# EAGLE schematic Atmega project (EAGLE 9.6.2)
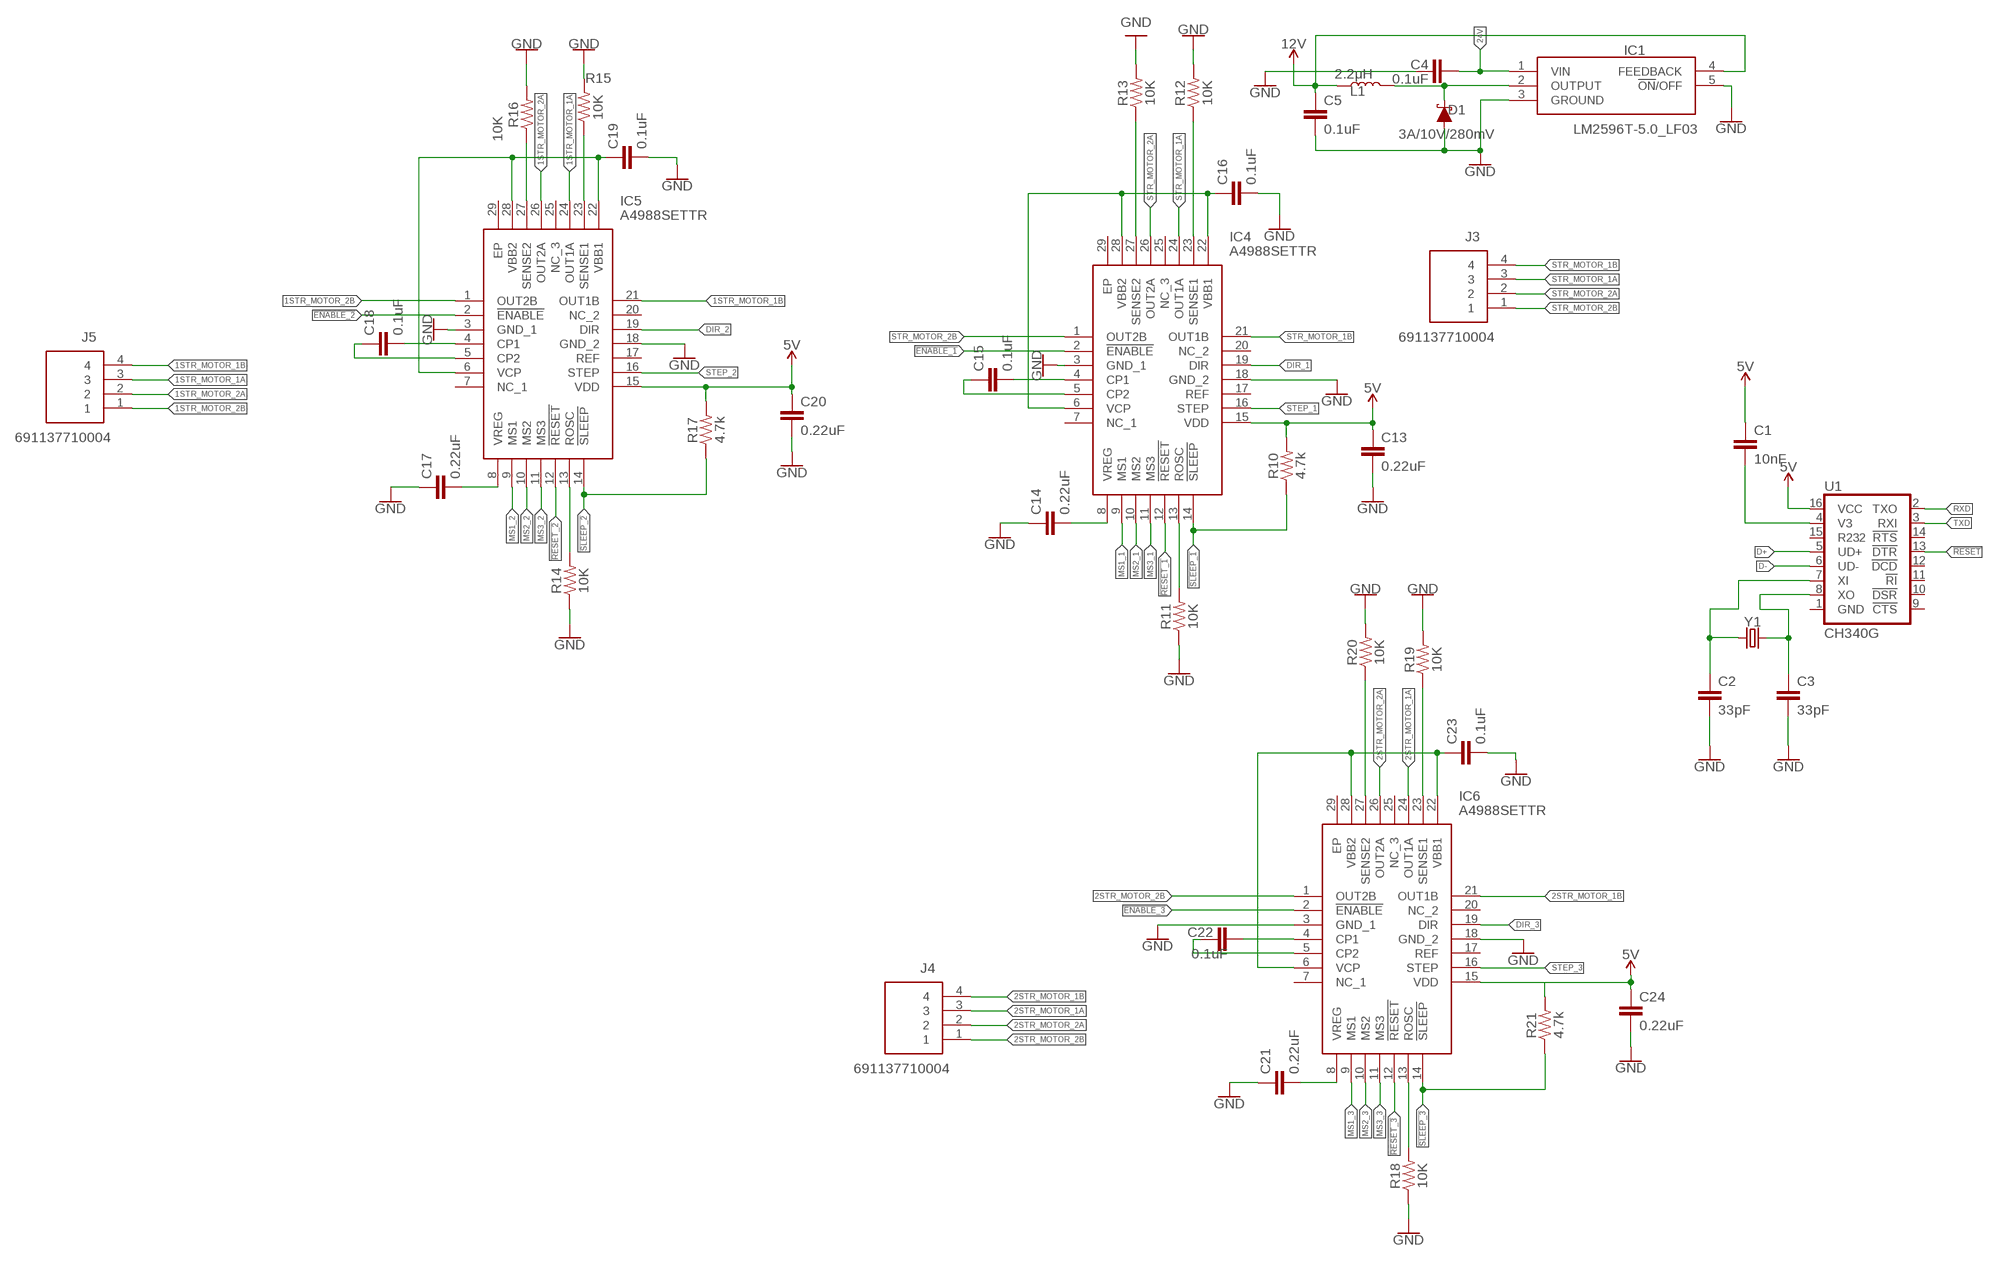
[diagram p0: schematic, sheet 1, part 1 of 2]
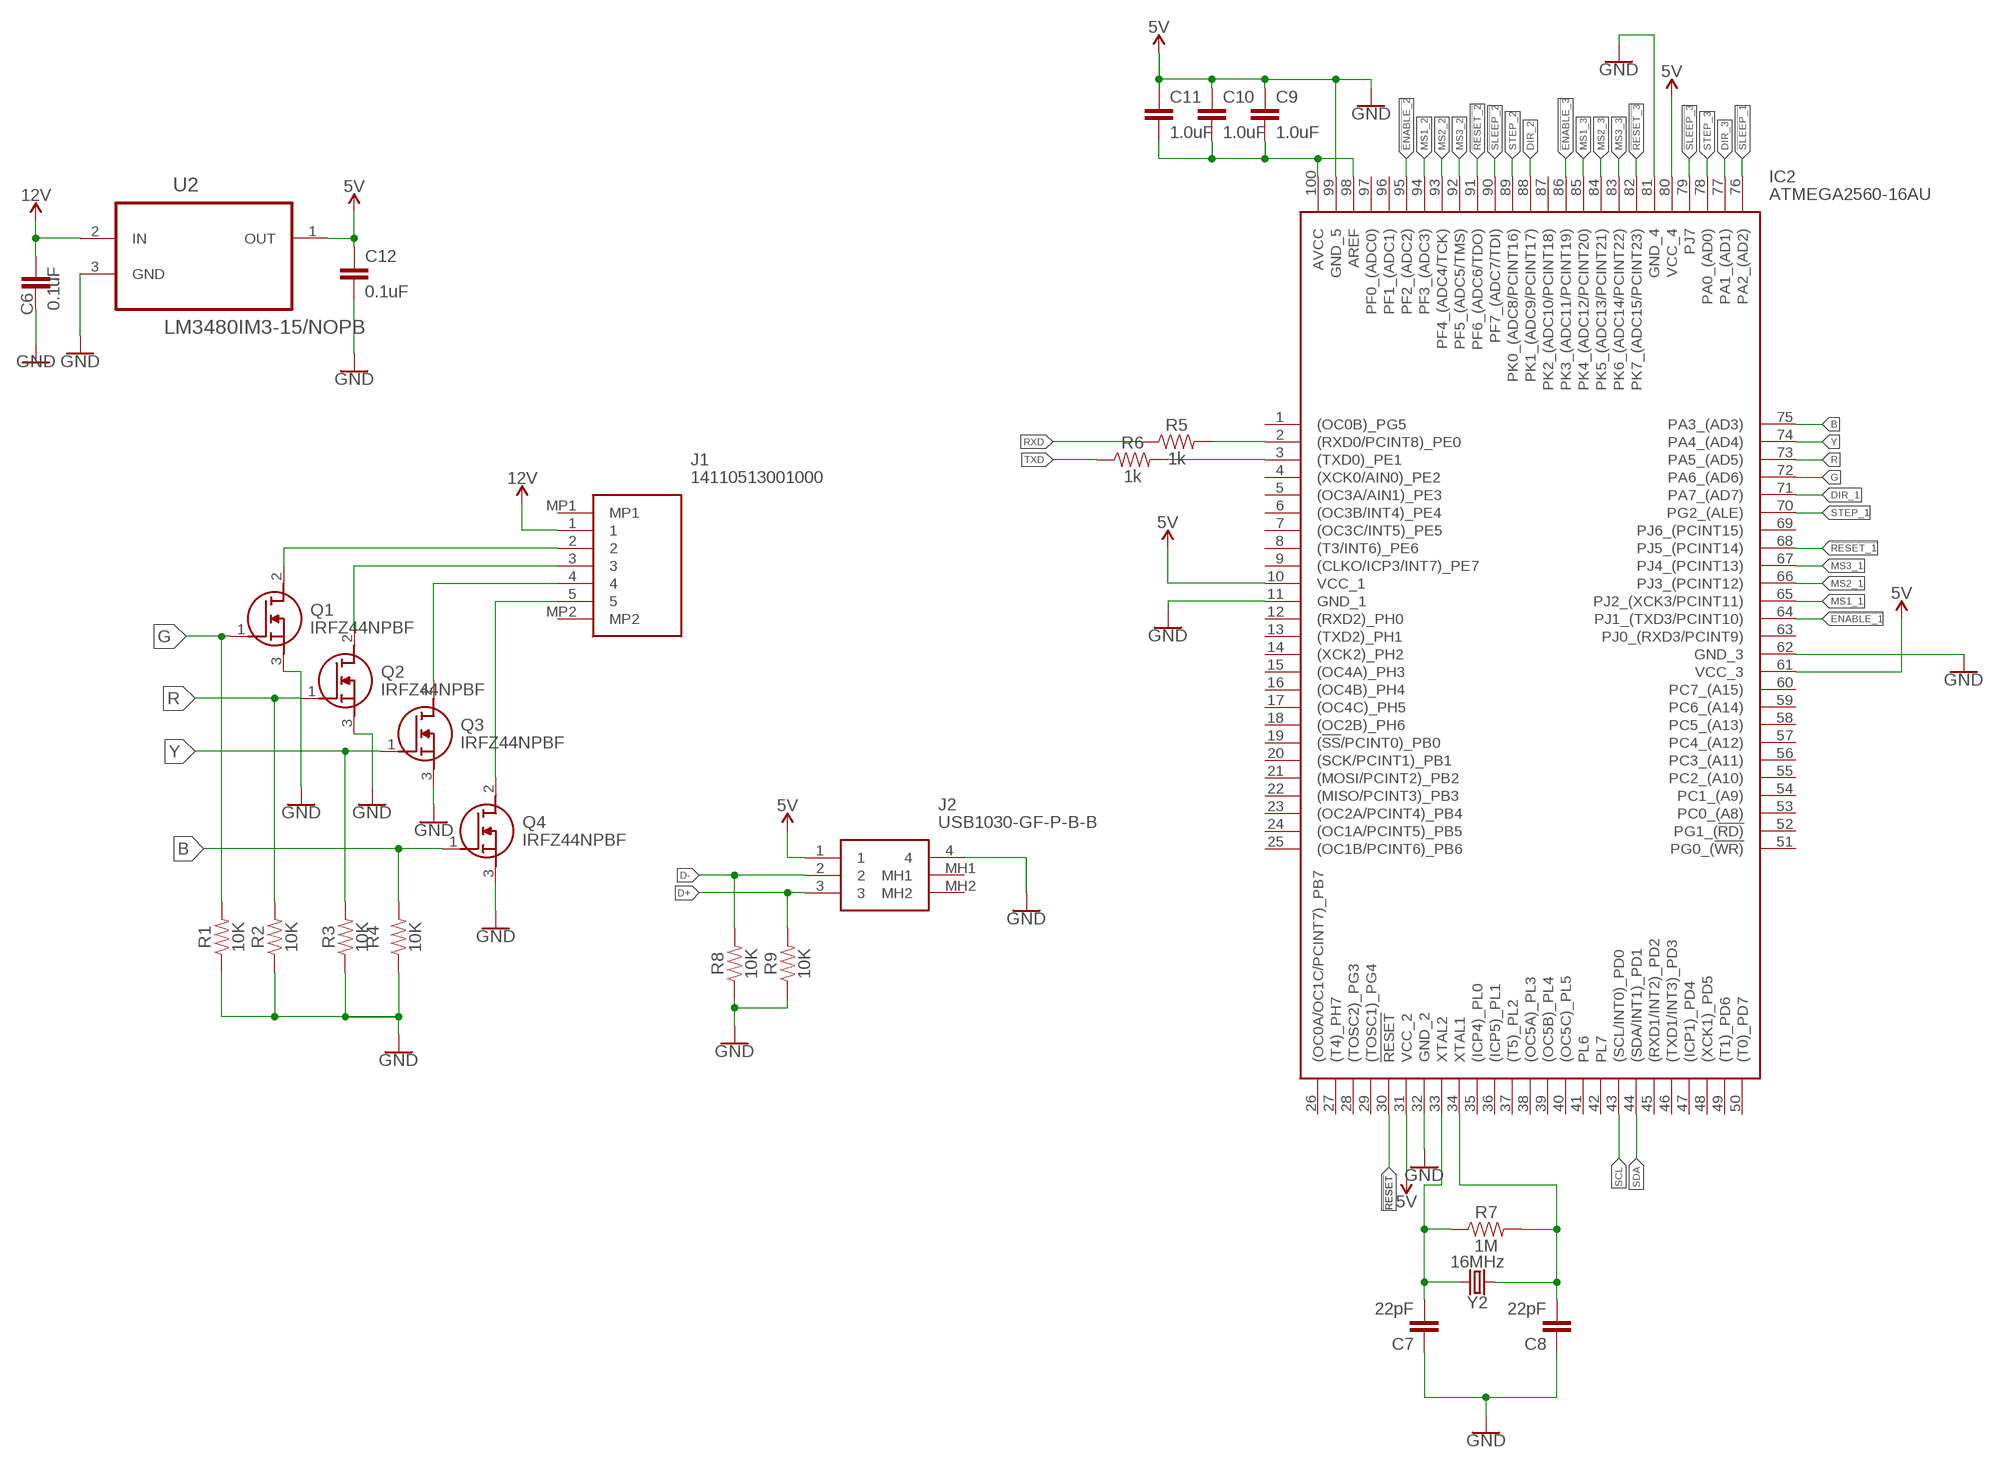
[diagram p1: schematic, sheet 1, part 2 of 2]

## Parts
C1  10nF  10NF-0402T-25V-10%  [0402-TIGHT]
C2  33pF  33PF-0402T-50V-5%  [0402-TIGHT]
C3  33pF  33PF-0402T-50V-5%  [0402-TIGHT]
C4  0.1uF  0.1UF-0603-25V-5%  [0603]
C5  0.1uF  0.1UF-0402T-16V-10%  [0402-TIGHT]
C6  0.1uF  0.1UF-0402T-16V-10%  [0402-TIGHT]
C7  22pF  22PF-0402T-16V-10%  [0402-TIGHT]
C8  22pF  22PF-0402T-16V-10%  [0402-TIGHT]
C9  1.0uF  1.0UF-0402T-16V-10%  [0402-TIGHT]
C10  1.0uF  1.0UF-0402T-16V-10%  [0402-TIGHT]
C11  1.0uF  1.0UF-0402T-16V-10%  [0402-TIGHT]
C12  0.1uF  0.1UF-0402T-6.3V-10%-X7R  [0402-TIGHT]
C13  0.22uF  0.22UF-0402T-10V-10%  [0402-TIGHT]
C14  0.22uF  0.22UF-0402T-10V-10%  [0402-TIGHT]
C15  0.1uF  0.1UF-0402T-10V-10%-X7R  [0402-TIGHT]
C16  0.1uF  0.1UF-0402T-10V-10%-X7R  [0402-TIGHT]
C17  0.22uF  0.22UF-0402T-10V-10%  [0402-TIGHT]
C18  0.1uF  0.1UF-0402T-10V-10%-X7R  [0402-TIGHT]
C19  0.1uF  0.1UF-0402T-10V-10%-X7R  [0402-TIGHT]
C20  0.22uF  0.22UF-0402T-10V-10%  [0402-TIGHT]
C21  0.22uF  0.22UF-0402T-10V-10%  [0402-TIGHT]
C22  0.1uF  0.1UF-0402T-10V-10%-X7R  [0402-TIGHT]
C23  0.1uF  0.1UF-0402T-10V-10%-X7R  [0402-TIGHT]
C24  0.22uF  0.22UF-0402T-10V-10%  [0402-TIGHT]
D1  3A/10V/280mV  DIODE-SCHOTTKY-BAT60A  [SOD-323]
IC1  LM2596T-5.0_LF03  [TO170P470X1028X2142-5P]
IC2  ATMEGA2560-16AU  [QFP50P1600X1600X120-100N]
IC4  A4988SETTR  [QFN50P500X500X100-29N]
IC5  A4988SETTR  [QFN50P500X500X100-29N]
IC6  A4988SETTR  [QFN50P500X500X100-29N]
J1  14110513001000  [14110513001000]
J2  USB1030-GF-P-B-B  [USB1030GFPBB]
J3  691137710004  [691137710004]
J4  691137710004  [691137710004]
J5  691137710004  [691137710004]
L1  2.2μH  2.2μH-0805_WIDE-2.2μH-1.7A-0.14OHM  [0805-WIDE]
Q1  IRFZ44NPBF  [TO254P483X1016X1994-3P]
Q2  IRFZ44NPBF  [TO254P483X1016X1994-3P]
Q3  IRFZ44NPBF  [TO254P483X1016X1994-3P]
Q4  IRFZ44NPBF  [TO254P483X1016X1994-3P]
R1  10K  10KOHM-0402-1/10W-0.1%  [0402-TIGHT]
R2  10K  10KOHM-0402-1/10W-0.1%  [0402-TIGHT]
R3  10K  10KOHM-0402-1/10W-0.1%  [0402-TIGHT]
R4  10K  10KOHM-0402-1/10W-0.1%  [0402-TIGHT]
R5  1k  1KOHM-0402T-1/16W-1%  [0402-TIGHT]
R6  1k  1KOHM-0402T-1/16W-1%  [0402-TIGHT]
R7  1M  1MOHM-0402T-1/16W-5%  [0402-TIGHT]
R8  10K  10KOHM-0402-1/10W-0.1%  [0402-TIGHT]
R9  10K  10KOHM-0402-1/10W-0.1%  [0402-TIGHT]
R10  4.7k  4.7KOHM-0402T-1/16W-1%  [0402-TIGHT]
R11  10K  10KOHM-0402-1/10W-0.1%  [0402-TIGHT]
R12  10K  10KOHM-0402-1/10W-0.1%  [0402-TIGHT]
R13  10K  10KOHM-0402-1/10W-0.1%  [0402-TIGHT]
R14  10K  10KOHM-0402-1/10W-0.1%  [0402-TIGHT]
R15  10K  10KOHM-0402-1/10W-0.1%  [0402-TIGHT]
R16  10K  10KOHM-0402-1/10W-0.1%  [0402-TIGHT]
R17  4.7k  4.7KOHM-0402T-1/16W-1%  [0402-TIGHT]
R18  10K  10KOHM-0402-1/10W-0.1%  [0402-TIGHT]
R19  10K  10KOHM-0402-1/10W-0.1%  [0402-TIGHT]
R20  10K  10KOHM-0402-1/10W-0.1%  [0402-TIGHT]
R21  4.7k  4.7KOHM-0402T-1/16W-1%  [0402-TIGHT]
U1  CH340G  CH340GSMD  [SO016]
U2  LM3480IM3-15/NOPB  [SOT95P251X112-3N]
Y1  CRYSTAL-12MHZ  [CRYSTAL-SMD-2X2.5MM]
Y2  16MHz  CRYSTAL-16MHZSMD-5X3.2  [CRYSTAL-SMD-5X3.2-4PAD]

## Nets
1STR_MOTOR_1A: IC5.24(OUT1A) J5.3
1STR_MOTOR_1B: IC5.21(OUT1B) J5.4
1STR_MOTOR_2A: IC5.26(OUT2A) J5.2
1STR_MOTOR_2B: IC5.1(OUT2B) J5.1
2STR_MOTOR_1A: IC6.24(OUT1A) J4.3
2STR_MOTOR_1B: IC6.21(OUT1B) J4.4
2STR_MOTOR_2A: IC6.26(OUT2A) J4.2
2STR_MOTOR_2B: IC6.1(OUT2B) J4.1
5V: C1.1 C9.1 C10.1 C11.1 C12.1 C13.1 C20.1 C24.1 IC2.10(VCC_1) IC2.31(VCC_2) IC2.61(VCC_3) IC2.80(VCC_4) IC2.99(GND_5) IC4.15(VDD) IC5.15(VDD) IC6.15(VDD) J2.1 R10.2 R17.2 R21.2 U1.16(VCC) U2.1(OUT) ; supply symbol labelled GND
12V: C5.1 C6.2 IC1.4(FEEDBACK) J1.1 L1.1 U2.2(IN)
24V: C4.2 IC1.1(VIN)
!ENABLE_1: IC2.64(PJ1_(TXD3/PCINT10)) IC4.2(!ENABLE)
!ENABLE_2: IC2.95(PF2_(ADC2)) IC5.2(!ENABLE)
!ENABLE_3: IC2.86(PK3_(ADC11/PCINT19)) IC6.2(!ENABLE)
!RESET: IC2.30(!RESET) U1.13(!DTR)
!RESET_1: IC2.68(PJ5_(PCINT14)) IC4.12(!RESET)
!RESET_2: IC2.91(PF6_(ADC6/TDO)) IC5.12(!RESET)
!RESET_3: IC2.82(PK7_(ADC15/PCINT23)) IC6.12(!RESET)
!SLEEP_1: IC2.76(PA2_(AD2)) IC4.14(!SLEEP) R10.1
!SLEEP_2: IC2.90(PF7_(ADC7/TDI)) IC5.14(!SLEEP) R17.1
!SLEEP_3: IC2.79(PJ7) IC6.14(!SLEEP) R21.1
B: IC2.75(PA3_(AD3)) Q4.1(G) R4.2
D+: J2.3 R9.2 U1.5(UD+)
D-: J2.2 R8.2 U1.6(UD-)
DIR_1: IC2.71(PA7_(AD7)) IC4.19(DIR)
DIR_2: IC2.88(PK1_(ADC9/PCINT17)) IC5.19(DIR)
DIR_3: IC2.77(PA1_(AD1)) IC6.19(DIR)
G: IC2.72(PA6_(AD6)) Q1.1(G) R1.2
GND: C2.2 C3.2 C4.1 C5.2 C6.1 C7.1 C8.1 C12.2 C13.2 C14.1 C16.2 C17.1 C19.2 C20.2 C21.1 C23.2 C24.2 D1.A IC1.3(GROUND) IC1.5(!ON!/OFF) IC2.11(GND_1) IC2.32(GND_2) IC2.62(GND_3) IC2.81(GND_4) IC4.3(GND_1) IC4.18(GND_2) IC5.3(GND_1) IC5.18(GND_2) IC6.3(GND_1) IC6.18(GND_2) J2.4 Q1.3(S) Q2.3(S) Q3.3(S) Q4.3(S) R1.1 R2.1 R3.1 R4.1 R8.1 R9.1 R11.1 R12.2 R13.2 R14.1 R15.2 R16.2 R18.1 R19.2 R20.2 U2.3(GND)
MS1_1: IC2.65(PJ2_(XCK3/PCINT11)) IC4.9(MS1)
MS1_2: IC2.94(PF3_(ADC3)) IC5.9(MS1)
MS1_3: IC2.85(PK4_(ADC12/PCINT20)) IC6.9(MS1)
MS2_1: IC2.66(PJ3_(PCINT12)) IC4.10(MS2)
MS2_2: IC2.93(PF4_(ADC4/TCK)) IC5.10(MS2)
MS2_3: IC2.84(PK5_(ADC13/PCINT21)) IC6.10(MS2)
MS3_1: IC2.67(PJ4_(PCINT13)) IC4.11(MS3)
MS3_2: IC2.92(PF5_(ADC5/TMS)) IC5.11(MS3)
MS3_3: IC2.83(PK6_(ADC14/PCINT22)) IC6.11(MS3)
N$1: C1.2 U1.4(V3)
N$2: J1.2 Q1.2(D)
N$3: J1.3 Q2.2(D)
N$4: J1.4 Q3.2(D)
N$5: J1.5 Q4.2(D)
N$6: C2.1 U1.7(XI) Y1.P1
N$7: C3.1 U1.8(XO) Y1.P3
N$8: C8.2 IC2.34(XTAL1) R7.2 Y2.1
N$9: C7.2 IC2.33(XTAL2) R7.1 Y2.3
N$11: C9.2 C10.2 C11.2 IC2.98(AREF) IC2.100(AVCC)
N$13: C14.2 IC4.8(VREG)
N$14: C15.2 IC4.4(CP1)
N$15: IC4.13(ROSC) R11.2
N$16: C15.1 IC4.5(CP2)
N$17: C16.1 IC4.6(VCP) IC4.22(VBB1) IC4.28(VBB2)
N$18: D1.C IC1.2(OUTPUT) L1.2
N$19: C21.2 IC6.8(VREG)
N$20: IC6.13(ROSC) R18.2
N$21: IC4.23(SENSE1) R12.1
N$22: IC4.27(SENSE2) R13.1
N$23: C22.2 IC6.4(CP1)
N$24: C22.1 IC6.5(CP2)
N$25: C17.2 IC5.8(VREG)
N$26: IC5.13(ROSC) R14.2
N$27: C18.2 IC5.4(CP1)
N$28: C18.1 IC5.5(CP2)
N$29: C19.1 IC5.6(VCP) IC5.22(VBB1) IC5.28(VBB2)
N$30: IC5.23(SENSE1) R15.1
N$31: IC5.27(SENSE2) R16.1
N$32: C23.1 IC6.6(VCP) IC6.22(VBB1) IC6.28(VBB2)
N$33: IC6.23(SENSE1) R19.1
N$34: IC6.27(SENSE2) R20.1
R: IC2.73(PA5_(AD5)) Q2.1(G) R2.2
RXD: IC2.2((RXD0/PCINT8)_PE0) R5.1 R5.2 U1.2(TXO)
SCL: IC2.43((SCL/INT0)_PD0)
SDA: IC2.44((SDA/INT1)_PD1)
STEP_1: IC2.70(PG2_(ALE)) IC4.16(STEP)
STEP_2: IC2.89(PK0_(ADC8/PCINT16)) IC5.16(STEP)
STEP_3: IC2.78(PA0_(AD0)) IC6.16(STEP)
STR_MOTOR_1A: IC4.24(OUT1A) J3.3
STR_MOTOR_1B: IC4.21(OUT1B) J3.4
STR_MOTOR_2A: IC4.26(OUT2A) J3.2
STR_MOTOR_2B: IC4.1(OUT2B) J3.1
TXD: IC2.3((TXD0)_PE1) R6.1 R6.2 U1.3(RXI)
Y: IC2.74(PA4_(AD4)) Q3.1(G) R3.2
Unconnected: IC2.1((OC0B)_PG5) IC2.4((XCK0/AIN0)_PE2) IC2.5((OC3A/AIN1)_PE3) IC2.6((OC3B/INT4)_PE4) IC2.7((OC3C/INT5)_PE5) IC2.8((T3/INT6)_PE6) IC2.9((CLKO/ICP3/INT7)_PE7) IC2.12((RXD2)_PH0) IC2.13((TXD2)_PH1) IC2.14((XCK2)_PH2) IC2.15((OC4A)_PH3) IC2.16((OC4B)_PH4) IC2.17((OC4C)_PH5) IC2.18((OC2B)_PH6) IC2.19((!SS!/PCINT0)_PB0) IC2.20((SCK/PCINT1)_PB1) IC2.21((MOSI/PCINT2)_PB2) IC2.22((MISO/PCINT3)_PB3) IC2.23((OC2A/PCINT4)_PB4) IC2.24((OC1A/PCINT5)_PB5) IC2.25((OC1B/PCINT6)_PB6) IC2.26((OC0A/OC1C/PCINT7)_PB7) IC2.27((T4)_PH7) IC2.28((TOSC2)_PG3) IC2.29((TOSC1)_PG4) IC2.35((ICP4)_PL0) IC2.36((ICP5)_PL1) IC2.37((T5)_PL2) IC2.38((OC5A)_PL3) IC2.39((OC5B)_PL4) IC2.40((OC5C)_PL5) IC2.41(PL6) IC2.42(PL7) IC2.45((RXD1/INT2)_PD2) IC2.46((TXD1/INT3)_PD3) IC2.47((ICP1)_PD4) IC2.48((XCK1)_PD5) IC2.49((T1)_PD6) IC2.50((T0)_PD7) IC2.51(PG0_(!WR)) IC2.52(PG1_(!RD)) IC2.53(PC0_(A8)) IC2.54(PC1_(A9)) IC2.55(PC2_(A10)) IC2.56(PC3_(A11)) IC2.57(PC4_(A12)) IC2.58(PC5_(A13)) IC2.59(PC6_(A14)) IC2.60(PC7_(A15)) IC2.63(PJ0_(RXD3/PCINT9)) IC2.69(PJ6_(PCINT15)) IC2.87(PK2_(ADC10/PCINT18)) IC2.96(PF1_(ADC1)) IC2.97(PF0_(ADC0)) IC4.7(NC_1) IC4.17(REF) IC4.20(NC_2) IC4.25(NC_3) IC4.29(EP) IC5.7(NC_1) IC5.17(REF) IC5.20(NC_2) IC5.25(NC_3) IC5.29(EP) IC6.7(NC_1) IC6.17(REF) IC6.20(NC_2) IC6.25(NC_3) IC6.29(EP) J1.MP1 J1.MP2 J2.MH1 J2.MH2 U1.1(GND) U1.9(!CTS) U1.10(!DSR) U1.11(!RI) U1.12(!DCD) U1.14(!RTS) U1.15(R232)

## Library data of the parts
C1 = SparkFun-Capacitors:10NF: 0.01uF/10nF/10,000pF ceramic capacitors A capacitor is a passive two-terminal electrical component used to store electrical energy temporarily in an electric field. CAP-09321; PROD_ID: CAP-14847
C2 C3 = SparkFun-Capacitors:33PF: 33pF ceramic capacitors A capacitor is a passive two-terminal electrical component used to store electrical energy temporarily in an electric field.; PROD_ID: CAP-15358
C4 = SparkFun-Capacitors:0.1UF: 0.1µF ceramic capacitors A capacitor is a passive two-terminal electrical component used to store electrical energy temporarily in an electric field.; PROD_ID: CAP-08604
C5 C6 = SparkFun-Capacitors:0.1UF: 0.1µF ceramic capacitors A capacitor is a passive two-terminal electrical component used to store electrical energy temporarily in an electric field.; PROD_ID: CAP-12416
C7 C8 = SparkFun-Capacitors:22PF: 22pF ceramic capacitors A capacitor is a passive two-terminal electrical component used to store electrical energy temporarily in an electric field.; PROD_ID: CAP-14674
C9-C11 = SparkFun-Capacitors:1.0UF: 1µF ceramic capacitors A capacitor is a passive two-terminal electrical component used to store electrical energy temporarily in an electric field.; PROD_ID: CAP-12417
C12 = SparkFun-Capacitors:0.1UF: 0.1µF ceramic capacitors A capacitor is a passive two-terminal electrical component used to store electrical energy temporarily in an electric field.; PROD_ID: CAP-14993
C13 C14 C17 C20 C21 C24 = SparkFun-Capacitors:0.22UF: 0.22µF ceramic capacitors A capacitor is a passive two-terminal electrical component used to store electrical energy temporarily in an electric field.; PROD_ID: CAP-14846
C15 C16 C18 C19 C22 C23 = SparkFun-Capacitors:0.1UF: 0.1µF ceramic capacitors A capacitor is a passive two-terminal electrical component used to store electrical energy temporarily in an electric field.; PROD_ID: CAP-15083
D1 = SparkFun-DiscreteSemi:DIODE-SCHOTTKY: Schottky diode A Schottky diode is a semiconductor diode which has a low forward voltage drop and a very fast switching action.; PROD_ID: DIO-14072
IC1 = LM2596T-5.0_LF03:LM2596T-5.0_LF03: SIMPLE SWITCHER 4.5V to 40V, 3A Low Component Count Step-Down Regulator Source: Datasheet <https://www.ti.com/lit/ds/symlink/lm2596.pdf?ts=1607069798907&ref_url=https%3A%2F%2Fwww.ti.com%2Fstore%2Fti%2Fen%2Fp%2Fproduct%2F%3Fp%3DLM2596T-5.0%2FLF03%26keyMatch%3DLM2596T-5.0%2FLF03%26tisearch%3DSearch-EN-everything%>; ARROW_PART_NUMBER: LM2596T-5.0/LF03; ARROW_PRICE-STOCK: https://www.arrow.com/en/products/lm2596t-5.0lf03/texas-instruments?region=nac; DESCRIPTION: SIMPLE SWITCHER 4.5V to 40V, 3A Low Component Count Step-Down Regulator; HEIGHT: 4.7mm; MANUFACTURER_NAME: Texas Instruments; MANUFACTURER_PART_NUMBER: LM2596T-5.0/LF03; MOUSER_PART_NUMBER: 926-LM2596T-50/LF03; MOUSER_PRICE-STOCK: https://www.mouser.co.uk/ProductDetail/Texas-Instruments/LM2596T-50-LF03?qs=X1J7HmVL2ZG6KM98hB9zGA%3D%3D
IC2 = ATMEGA2560-16AU:ATMEGA2560-16AU: ATMEGA2560-16AU, 8 bit AVR Microcontroller 16MHz 4, 256kb Flash, 8kb RAM, I2C SPI 100-Pin TQFP Source: Datasheet <https://datasheet.datasheetarchive.com/originals/distributors/Datasheets_SAMA/4a5a397fa76c39b5297f4121ace1d84e.pdf>; ARROW_PART_NUMBER: ATMEGA2560-16AU; ARROW_PRICE-STOCK: https://www.arrow.com/en/products/atmega2560-16au/microchip-technology?region=nac; DESCRIPTION: ATMEGA2560-16AU, 8 bit AVR Microcontroller 16MHz 4, 256kb Flash, 8kb RAM, I2C SPI 100-Pin TQFP; HEIGHT: 1.2mm; MANUFACTURER_NAME: Microchip; MANUFACTURER_PART_NUMBER: ATMEGA2560-16AU; MOUSER_PART_NUMBER: 556-ATMEGA2560-16AU; MOUSER_PRICE-STOCK: https://www.mouser.co.uk/ProductDetail/Microchip-Technology-Atmel/ATMEGA2560-16AU?qs=aqrrBurbvGciYmlAokFS0w%3D%3D
IC4-IC6 = A4988SETTR:A4988SETTR: Allegro Microsystems A4988SETTR, Stepper Motor Driver IC, 35 V +/-2A 28-Pin, QFN Source: Datasheet <https://www.allegromicro.com/~/media/Files/Datasheets/A4988-Datasheet.ashx>; DESCRIPTION: Allegro Microsystems A4988SETTR, Stepper Motor Driver IC, 35 V +/-2A 28-Pin, QFN; HEIGHT: 1mm; MANUFACTURER_NAME: Allegro Microsystems; MANUFACTURER_PART_NUMBER: A4988SETTR
J1 = 14110513001000:14110513001000: 5 contacts Vertical mount SMT Source: Datasheet <https://b2b.harting.com/files/download/PRD/PDF_TS/1411XX13001XXX_100228421DRW046C.pdf>; ARROW_PART_NUMBER: 14110513001000; ARROW_PRICE-STOCK: https://www.arrow.com/en/products/14110513001000/harting; DESCRIPTION: 5 contacts Vertical mount SMT; HEIGHT: 7.45mm; MANUFACTURER_NAME: HARTING; MANUFACTURER_PART_NUMBER: 14110513001000; MOUSER_PART_NUMBER: 617-14110513001000; MOUSER_PRICE-STOCK: https://www.mouser.co.uk/ProductDetail/HARTING/14110513001000?qs=9nYkJLYMUzvq4GdFieWOAA%3D%3D
J2 = USB1030-GF-P-B-B:USB1030-GF-P-B-B: USB Connectors USB B Skt, Top TH, R/A, GF, Wth kinked shell stake, tray Source: Datasheet <https://gct.co/files/drawings/usb1030.pdf?v=6f3e53a4-19ab-41a0-8ac3-960e4d6fce65>; DESCRIPTION: USB Connectors USB B Skt, Top TH, R/A, GF, Wth kinked shell stake, tray; HEIGHT: 11.2mm; MANUFACTURER_NAME: GCT (GLOBAL CONNECTOR TECHNOLOGY); MANUFACTURER_PART_NUMBER: USB1030-GF-P-B-B; MOUSER_PART_NUMBER: 640-USB1030-GF-P-B-B; MOUSER_PRICE-STOCK: https://www.mouser.co.uk/ProductDetail/GCT/USB1030-GF-P-B-B?qs=KUoIvG%2F9Ila4yhPpaOZhHA%3D%3D
J3-J5 = 691137710004:691137710004: Wurth Elektronik, WR-TBL 5mm Pitch, 4 Way PCB Terminal Block Source: Datasheet <https://www.we-online.com/catalog/datasheet/691137710004.pdf>; DESCRIPTION: Wurth Elektronik, WR-TBL 5mm Pitch, 4 Way PCB Terminal Block; HEIGHT: 11.6mm; MANUFACTURER_NAME: Wurth Elektronik; MANUFACTURER_PART_NUMBER: 691137710004; MOUSER_PART_NUMBER: 710-691137710004; MOUSER_PRICE-STOCK: https://www.mouser.co.uk/ProductDetail/Wurth-Elektronik/691137710004?qs=lBTPRtX1sU%2F%2FMst6RmLNCA%3D%3D
L1 = SparkFun-Coils:2.2μH: 2.2μH Inductor Resist changes in electrical current. Basically a coil of wire. SparkFun Products: SparkFun Edge - HX711 <https://www.sparkfun.com/products/15170>; PROD_ID: NDUC-14234
Q1-Q4 = IRFZ44NPBF:IRFZ44NPBF: MOSFET N-Channel 55V 49A TO220AB Infineon IRFZ44NPBF N-channel MOSFET Transistor, 49 A, 55 V, 3-Pin TO-220AB Source: Datasheet <https://www.infineon.com/dgdl/irfz44npbf.pdf?fileId=5546d462533600a40153563b3a9f220d>; ARROW_PART_NUMBER: IRFZ44NPBF; ARROW_PRICE-STOCK: https://www.arrow.com/en/products/irfz44npbf/infineon-technologies-ag?region=nac; DESCRIPTION: MOSFET N-Channel 55V 49A TO220AB Infineon IRFZ44NPBF N-channel MOSFET Transistor, 49 A, 55 V, 3-Pin TO-220AB; HEIGHT: 4.83mm; MANUFACTURER_NAME: Infineon; MANUFACTURER_PART_NUMBER: IRFZ44NPBF; MOUSER_PART_NUMBER: 942-IRFZ44NPBF; MOUSER_PRICE-STOCK: https://www.mouser.co.uk/ProductDetail/Infineon-IR/IRFZ44NPBF?qs=9%252BKlkBgLFf24zghzPg2f9g%3D%3D
R1-R4 R8 R9 R11-R16 R18-R20 = SparkFun-Resistors:10KOHM: 10kΩ resistor A resistor is a passive two-terminal electrical component that implements electrical resistance as a circuit element. Resistors act to reduce current flow, and, at the same time, act to lower voltage levels within circuits. - Wikipedia; PROD_ID: RES-16147
R5 R6 = SparkFun-Resistors:1KOHM: 1kΩ resistor A resistor is a passive two-terminal electrical component that implements electrical resistance as a circuit element. Resistors act to reduce current flow, and, at the same time, act to lower voltage levels within circuits. - Wikipedia; PROD_ID: RES-14342
R7 = SparkFun-Resistors:1MOHM: 1MΩ resistor A resistor is a passive two-terminal electrical component that implements electrical resistance as a circuit element. Resistors act to reduce current flow, and, at the same time, act to lower voltage levels within circuits. - Wikipedia; PROD_ID: RES-15185
R10 R17 R21 = SparkFun-Resistors:4.7KOHM: 4.7kΩ resistor A resistor is a passive two-terminal electrical component that implements electrical resistance as a circuit element. Resistors act to reduce current flow, and, at the same time, act to lower voltage levels within circuits. - Wikipedia; PROD_ID: RES-15343
U1 = SparkFun-IC-Comms:CH340G: A simple USB 2.0 to Serial IC.; PROD_ID: IC-13498
U2 = LM3480IM3-15_NOPB:LM3480IM3-15/NOPB: Low-Dropout Linear Voltage Check availability <https://pricing.snapeda.com/parts/LM3480IM3-15/NOPB/Texas%20Instruments/view-part?ref=eda>; AVAILABILITY: In Stock; DESCRIPTION: 100-mA, 30-V, low-dropout voltage regulator; MF: Texas Instruments; MP: LM3480IM3-15/NOPB; PACKAGE: SOT-23-3 Texas Instruments; PRICE: None; PURCHASE-URL: https://pricing.snapeda.com/search/part/LM3480IM3-15/NOPB/?ref=eda
Y1 = SparkFun-Clocks:CRYSTAL-12MHZ: 12.0MHz Crystal Frequency: 12.0MHz Frequency Tolerance: ±20ppm Load Capacitance: 18pF SparkFun Products: SparkFun Logomatic <https://www.sparkfun.com/products/12772> Pocket AVR Programmer <https://www.sparkfun.com/products/9825>; PROD_ID: XTAL-15540
Y2 = SparkFun-Clocks:CRYSTAL-16MHZ: 16MHz Crystal Digikey Example <http://www.digikey.com/product-search/en?keywords=535-9122-1-ND> Frequency: 16MHz Frequency Stability: ±50ppm Frequency Tolerance: ±20ppm Load Capacitance: 18pF SparkFun Products: Pro Micro -5V/16MHz <https://www.sparkfun.com/products/12640> SparkFun Serial Enabled LCD Kit <https://www.sparkfun.com/products/10097>; PROD_ID: XTAL-08218; SF_ID: COM-00094